# EAGLE design Power_Buggy_EFI_V3.1 (EAGLE 9.2.2)
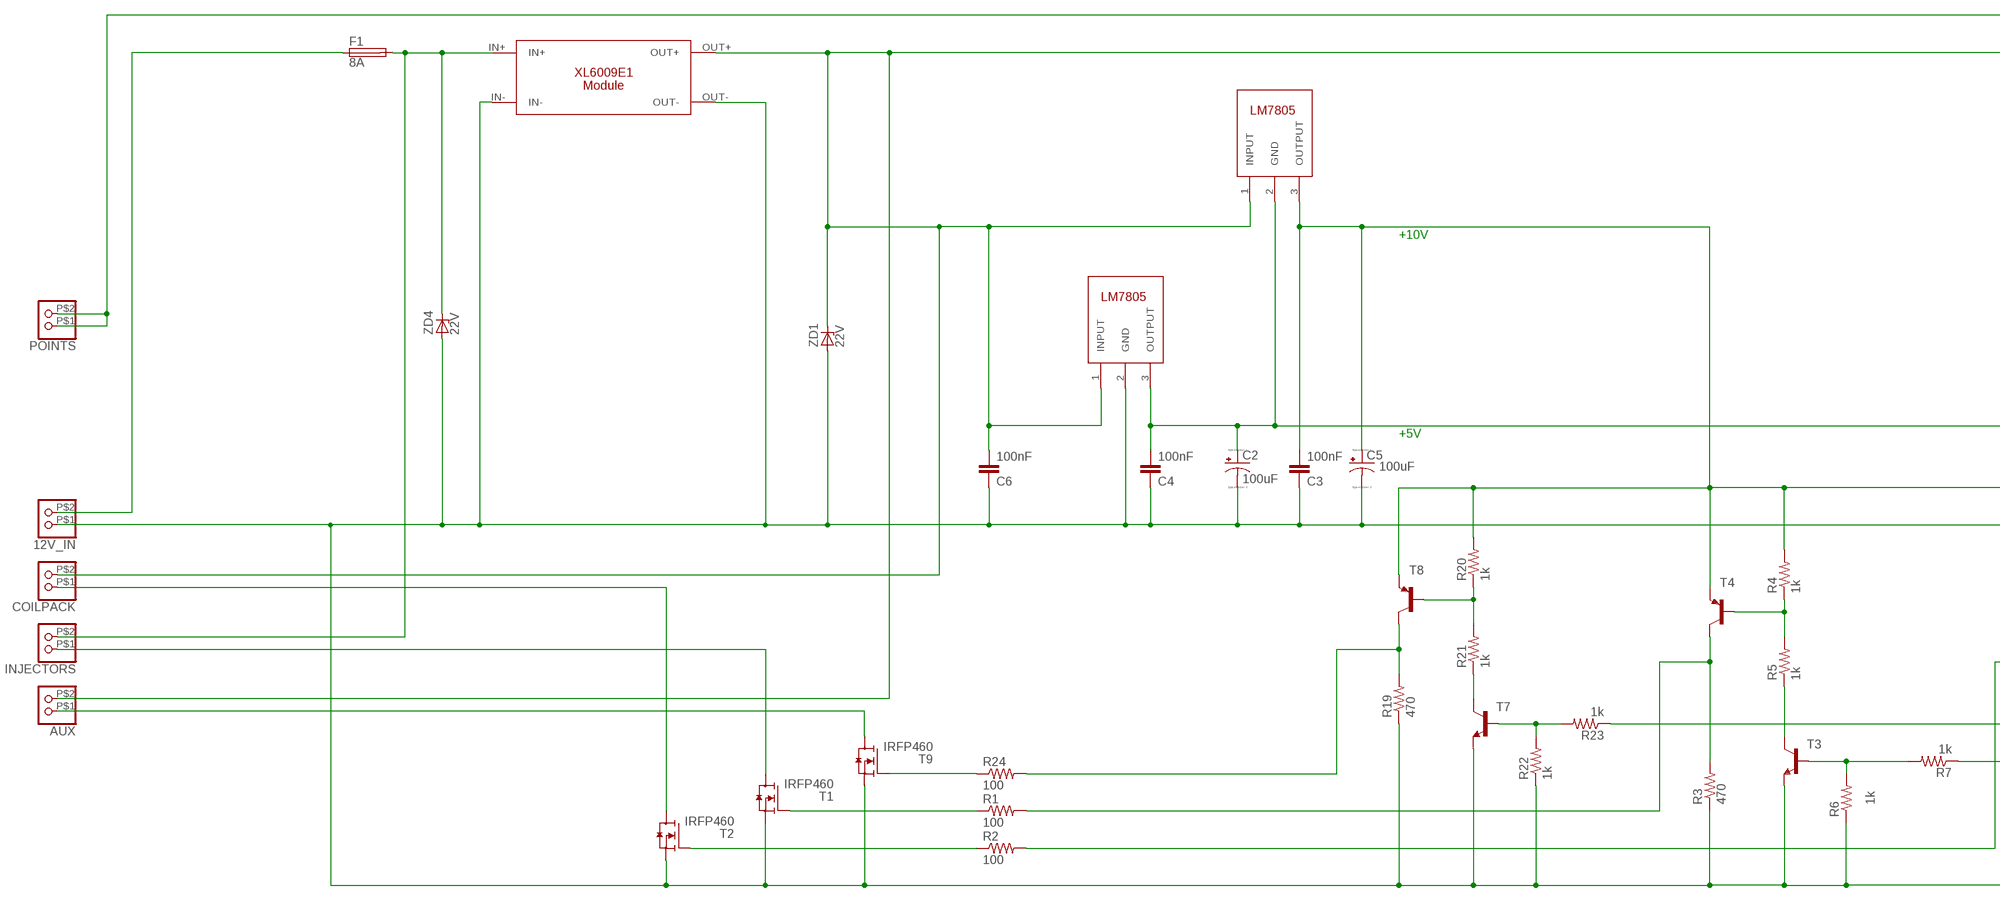
[diagram p0: schematic, sheet 1, part 1 of 2]
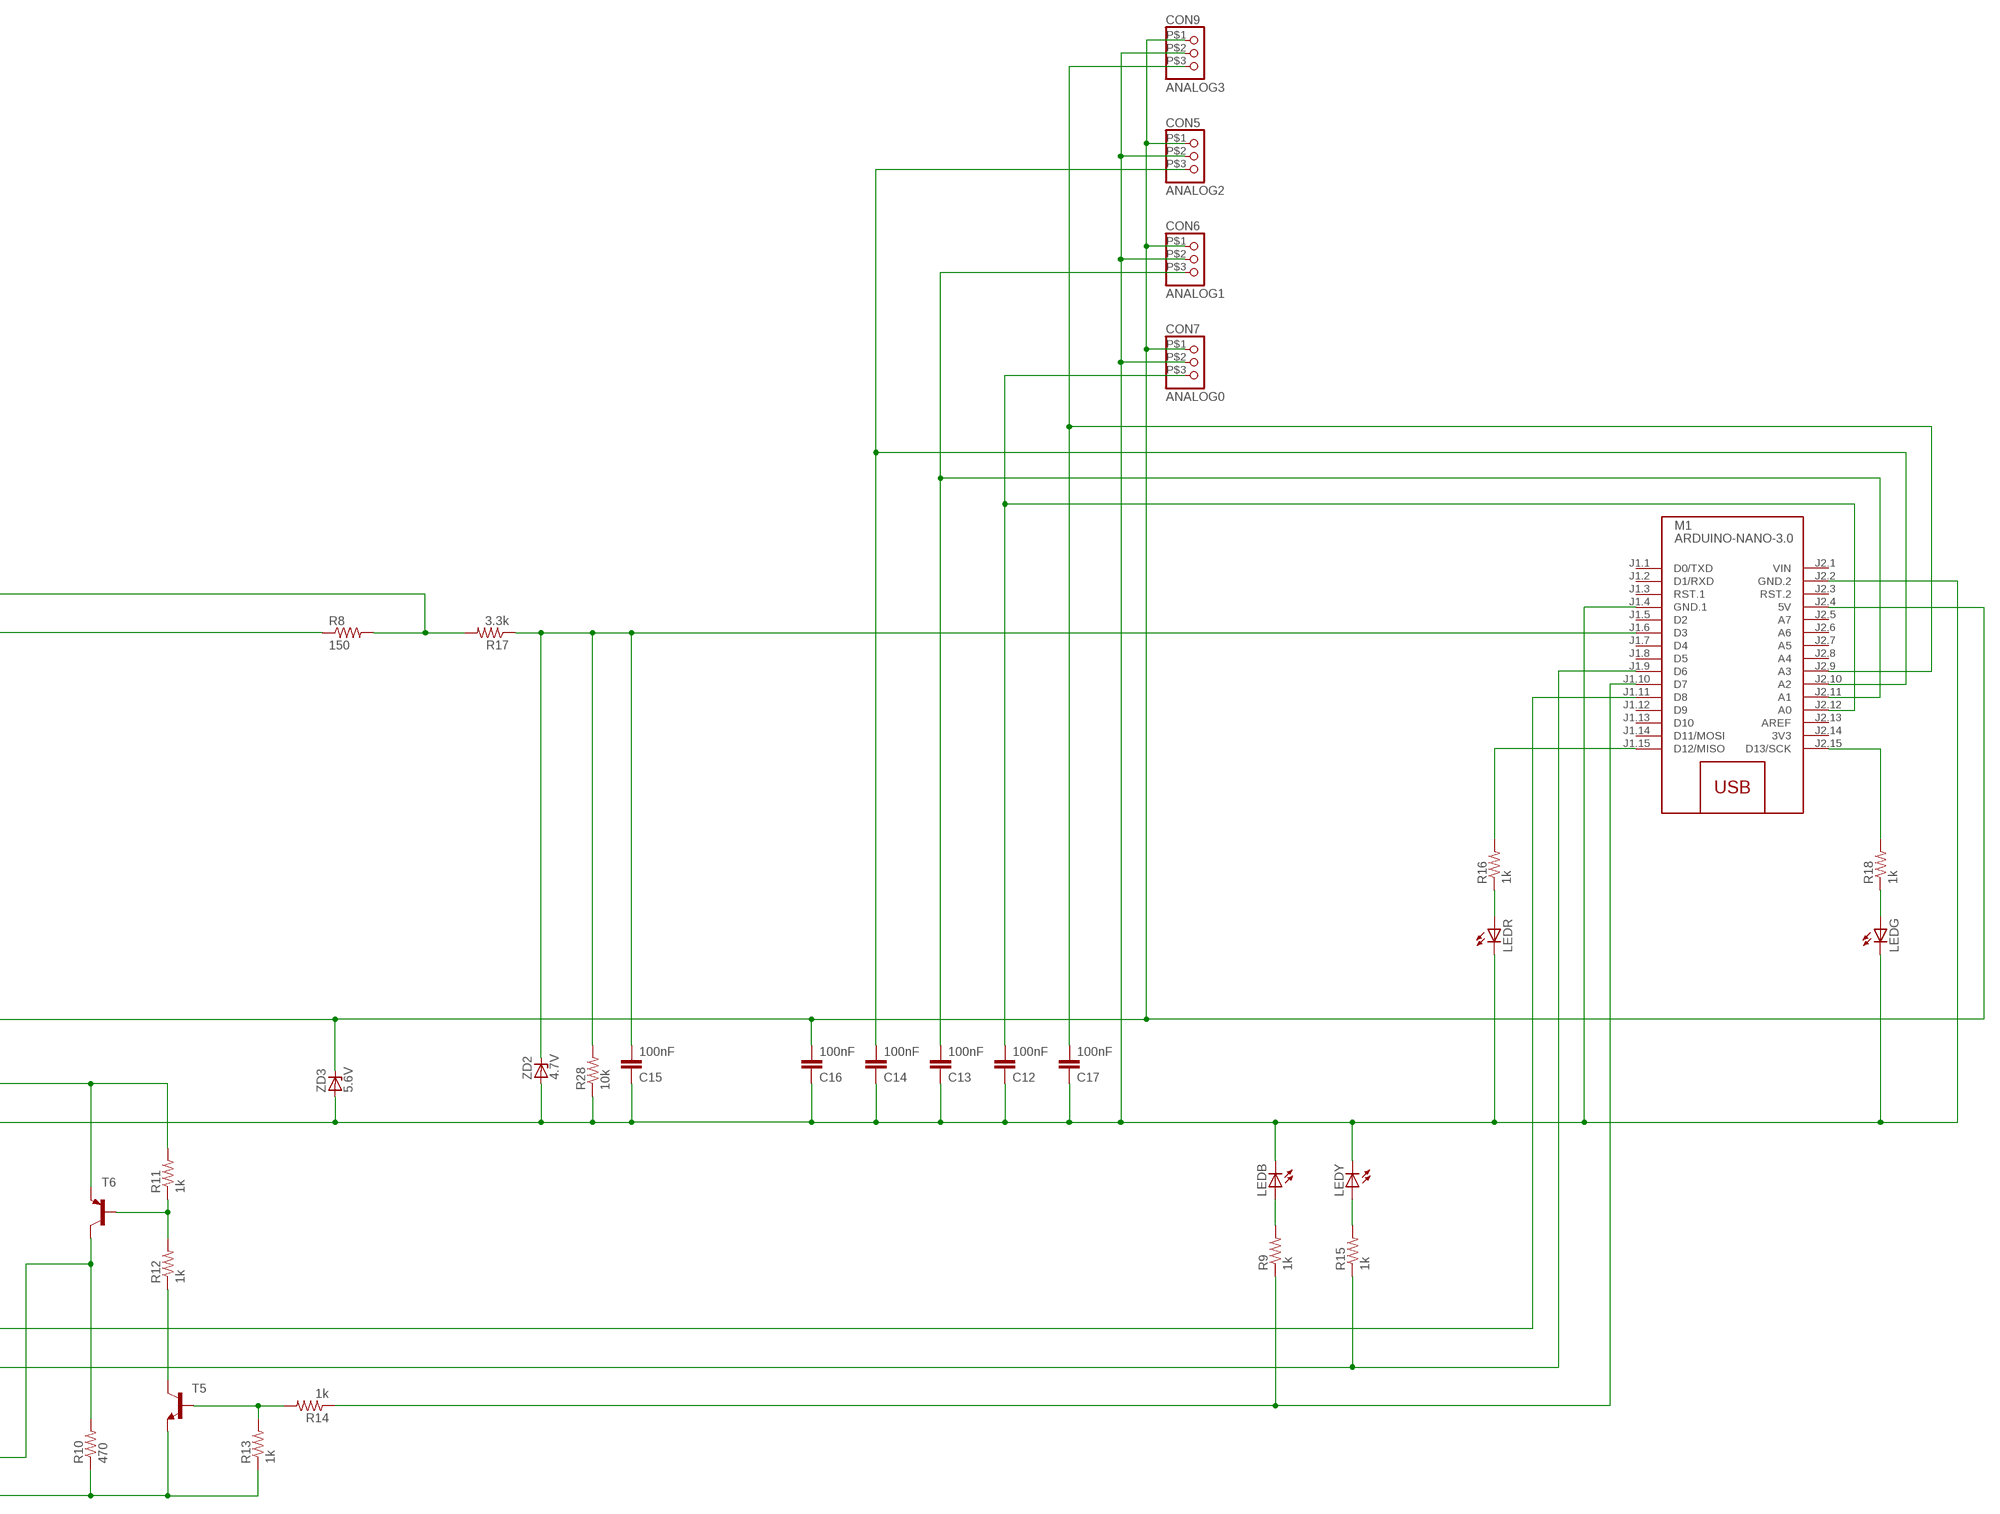
[diagram p1: schematic, sheet 1, part 2 of 2]

## Parts
12V_IN  EBBA-02-C-SS-BU  [EBBA-02-C-SS-BU]
AUX  EBBA-02-C-SS-BU  [EBBA-02-C-SS-BU]
C2  100uF  CPOL-USE2-5  [E2-5]
C3  100nF  C-EU050-025X075  [C050-025X075]
C4  100nF  C-EU050-025X075  [C050-025X075]
C5  100uF  CPOL-USE2-5  [E2-5]
C6  100nF  C-EU050-025X075  [C050-025X075]
C12  100nF  C-EU050-025X075  [C050-025X075]
C13  100nF  C-EU050-025X075  [C050-025X075]
C14  100nF  C-EU050-025X075  [C050-025X075]
C15  100nF  C-EU050-025X075  [C050-025X075]
C16  100nF  C-EU050-025X075  [C050-025X075]
C17  100nF  C-EU050-025X075  [C050-025X075]
COILPACK  EBBA-02-C-SS-BU  [EBBA-02-C-SS-BU]
CON5  ANALOG2  2.0MM_X3  [2.0MM_X3]
CON6  ANALOG1  2.0MM_X3  [2.0MM_X3]
CON7  ANALOG0  2.0MM_X3  [2.0MM_X3]
CON9  ANALOG3  2.0MM_X3  [2.0MM_X3]
F1  8A  GSH15  [GSH15]
INJECTORS  EBBA-02-C-SS-BU  [EBBA-02-C-SS-BU]
LEDB  LED3MM  [LED3MM]
LEDG  LED3MM  [LED3MM]
LEDR  LED3MM  [LED3MM]
LEDY  LED3MM  [LED3MM]
M1  ARDUINO-NANO-3.0  [ARDUINO-NANO-3.0]
POINTS  EBBA-02-C-SS-BU  [EBBA-02-C-SS-BU]
R1  100  R-US_0207/10  [0207/10]
R2  100  R-US_0207/10  [0207/10]
R3  470  R-US_0207/10  [0207/10]
R4  1k  R-US_0207/10  [0207/10]
R5  1k  R-US_0207/10  [0207/10]
R6  1k  R-US_0207/10  [0207/10]
R7  1k  R-US_0207/10  [0207/10]
R8  150  R-US_0617/22  [0617/22]
R9  1k  R-US_0207/10  [0207/10]
R10  470  R-US_0207/10  [0207/10]
R11  1k  R-US_0207/10  [0207/10]
R12  1k  R-US_0207/10  [0207/10]
R13  1k  R-US_0207/10  [0207/10]
R14  1k  R-US_0207/10  [0207/10]
R15  1k  R-US_0207/10  [0207/10]
R16  1k  R-US_0207/10  [0207/10]
R17  3.3k  R-US_0207/10  [0207/10]
R18  1k  R-US_0207/10  [0207/10]
R19  470  R-US_0207/10  [0207/10]
R20  1k  R-US_0207/10  [0207/10]
R21  1k  R-US_0207/10  [0207/10]
R22  1k  R-US_0207/10  [0207/10]
R23  1k  R-US_0207/10  [0207/10]
R24  100  R-US_0207/10  [0207/10]
R28  10k  R-US_0207/10  [0207/10]
REG1  LM7805_VERT  [TO220_VERT]
REG2  LM7805_VERT  [TO220_VERT]
T1  IRFP460  MOSFET_VERT  [TO-247_HORIZONTAL]
T2  IRFP460  MOSFET_VERT  [TO-247_HORIZONTAL]
T3  -NPN-TO92-EBC  [TO92-EBC]
T4  BCX58-PNP-TO92-EBC  [TO92-EBC]
T5  -NPN-TO92-EBC  [TO92-EBC]
T6  BCX58-PNP-TO92-EBC  [TO92-EBC]
T7  -NPN-TO92-EBC  [TO92-EBC]
T8  BCX58-PNP-TO92-EBC  [TO92-EBC]
T9  IRFP460  MOSFET_VERT  [TO-247_HORIZONTAL]
U$2  XL6009E1_MOD  [XL6009E1_MOD]
ZD1  22V  1N5333  [C1702-15]
ZD2  4.7V  1N4728  [DO41Z10]
ZD3  5.6V  1N5333  [C1702-15]
ZD4  22V  1N5333  [C1702-15]

## Nets
N$1: R19.2 R24.2 T8.C
N$2: AUX.P$2 C6.2 COILPACK.P$2 R8.1 REG1.1(INPUT) REG2.1(INPUT) U$2.OUT+ ZD1.C
N$3: 12V_IN.P$1 C2.- C3.1 C4.1 C5.- C6.1 C12.1 C13.1 C14.1 C15.1 C16.1 C17.1 CON5.P$2 CON6.P$2 CON7.P$2 CON9.P$2 LEDB.K(C) LEDG.K(C) LEDR.K(C) LEDY.K(C) M1.J1.4(GND.1) M1.J2.2(GND.2) R3.1 R6.1 R10.1 R13.1 R19.1 R22.1 R28.1 REG1.2(GND) T1.S T2.S T3.E T5.E T7.E T9.S U$2.IN- U$2.OUT- ZD1.A ZD2.A ZD3.A ZD4.A
N$4: C17.2 CON9.P$3 M1.J2.9(A3)
N$5: INJECTORS.P$1 T1.D
N$6: C3.2 C5.+ R4.2 R11.2 R20.2 REG2.3(OUTPUT) T4.E T6.E T8.E
N$7: COILPACK.P$1 T2.D
N$8: R2.1 T2.G
N$9: R1.1 T1.G
N$10: R1.2 R3.2 T4.C
N$11: R5.1 T3.C
N$12: R6.2 R7.2 T3.B
N$13: R4.1 R5.2 T4.B
N$14: M1.J1.9(D6) R7.1 R15.1
N$15: R20.1 R21.2 T8.B
N$16: M1.J1.10(D7) R9.1 R14.1
N$17: C2.+ C4.2 C16.2 CON5.P$1 CON6.P$1 CON7.P$1 CON9.P$1 M1.J2.4(5V) REG1.3(OUTPUT) REG2.2(GND) ZD3.C
N$18: F1.2 INJECTORS.P$2 U$2.IN+ ZD4.C
N$19: R2.2 R10.2 T6.C
N$20: M1.J1.15(D12/MISO) R16.2
N$21: R11.1 R12.2 T6.B
N$22: 12V_IN.P$2 F1.1
N$23: R12.1 T5.C
N$24: LEDR.A R16.1
N$25: M1.J2.15(D13/SCK) R18.2
N$26: LEDG.A R18.1
N$27: C15.2 M1.J1.6(D3) R17.1 R28.2 ZD2.C
N$28: POINTS.P$1 POINTS.P$2 R8.2 R17.2
N$29: LEDY.A R15.2
N$30: LEDB.A R9.2
N$31: R21.1 T7.C
N$33: R22.2 R23.2 T7.B
N$34: C12.2 CON7.P$3 M1.J2.12(A0)
N$35: R13.2 R14.2 T5.B
N$36: M1.J1.11(D8) R23.1
N$37: C13.2 CON6.P$3 M1.J2.11(A1)
N$38: R24.1 T9.G
N$39: AUX.P$1 T9.D
N$50: C14.2 CON5.P$3 M1.J2.10(A2)
Unconnected: M1.J1.1(D0/TXD) M1.J1.2(D1/RXD) M1.J1.3(RST.1) M1.J1.5(D2) M1.J1.7(D4) M1.J1.8(D5) M1.J1.12(D9) M1.J1.13(D10) M1.J1.14(D11/MOSI) M1.J2.3(RST.2) M1.J2.5(A7) M1.J2.6(A6) M1.J2.7(A5) M1.J2.8(A4) M1.J2.13(AREF)

## Notes on the sheet
- +10V
- +5V

## Power pins joined to a net without a drawn wire
3V3: M1.J2.14(3V3)
VIN: M1.J2.1(VIN)

## Library data of the parts
12V_IN AUX COILPACK INJECTORS POINTS = Portable_Cal_Parts_SM:EBBA-02-C-SS-BU
C2 C5 = resistor:CPOL-US: POLARIZED CAPACITOR, American symbol
C3 C4 C6 C12-C17 = resistor:C-EU: CAPACITOR, European symbol
CON5-CON7 CON9 = Power_Buggy_Parts:2.0MM_X3
F1 = fuse:GSH15: FUSE HOLDER grid 15mm, 19649 Wickmann; MPN: 64900001039; OC_FARNELL: 1271673; OC_NEWARK: 02P0318
LEDB LEDG LEDR LEDY = led:LED: LED OSRAM: - CHIPLED LG R971, LG N971, LY N971, LG Q971, LY Q971, LO R971, LY R971 LH N974, LH R974 LS Q976, LO Q976, LY Q976 LO Q996 - Hyper CHIPLED LW Q18S LB Q993, LB Q99A, LB R99A - SideLED LS A670, LO A670, LY A670, LG A670, LP A670 LB A673, LV A673, LT A673, LW A673 LH A674 LY A675 LS A676, LA A676, LO A676, LY A676, LW A676 LS A679, LY A679, LG A679 - Hyper Micro SIDELED® LS Y876, LA Y876, LO Y876, LY Y876 LT Y87S - SmartLED LW L88C, LW L88S LB L89C, LB L89S, LG L890 LS L89K, LO L89K, LY L89K LS L896, LA L896, LO L896, LY L896 - TOPLED LS T670, LO T670, LY T670, LG T670, LP T670 LSG T670, LSP T670, LSY T670, LOP T670, LYG T670 LG T671, LOG T671, LSG T671 LB T673, LV T673, LT T673, LW T673 LH T674 LS T676, LA T676, LO T676, LY T676, LB T676, LH T676, LSB T676, LW T676 LB T67C, LV T67C, LT T67C, LS T67K, LO T67K, LY T67K, LW E67C LS E67B, LA E67B, LO E67B, LY E67B, LB E67C, LV E67C, LT E67C LW T67C LS T679, LY T679, LG T679 LS T770, LO T770, LY T770, LG T770, LP T770 LB T773, LV T773, LT T773, LW T773 LH T774 LS E675, LA E675, LY E675, LS T675 LS T776, LA T776, LO T776, LY T776, LB T776 LHGB T686 LT T68C, LB T68C - Hyper Mini TOPLED® LB M676 - Mini TOPLED Santana® LG M470 LS M47K, LO M47K, LY M47K Source: http://www.osram.convergy.de LUXEON: - LUMILED® LXK2-PW12-R00, LXK2-PW12-S00, LXK2-PW14-U00, LXK2-PW14-V00 LXK2-PM12-R00, LXK2-PM12-S00, LXK2-PM14-U00 LXK2-PE12-Q00, LXK2-PE12-R00, LXK2-PE12-S00, LXK2-PE14-T00, LXK2-PE14-U00 LXK2-PB12-K00, LXK2-PB12-L00, LXK2-PB12-M00, LXK2-PB14-N00, LXK2-PB14-P00, LXK2-PB14-Q00 LXK2-PR12-L00, LXK2-PR12-M00, LXK2-PR14-Q00, LXK2-PR14-R00 LXK2-PD12-Q00, LXK2-PD12-R00, LXK2-PD12-S00 LXK2-PH12-R00, LXK2-PH12-S00 LXK2-PL12-P00, LXK2-PL12-Q00, LXK2-PL12-R00 Source: www.luxeon.com KINGBRIGHT: KA-3528ASYC Source: www.kingbright.com
M1 = diy-modules:ARDUINO-NANO-3.0: Arduino Nano 3.0
R1-R24 R28 = resistor:R-US_: RESISTOR, American symbol
REG1 REG2 = Portable_Cal_Parts_SM:LM7805_VERT
T1 T2 T9 = Inverter_Parts:MOSFET_VERT
T3 T5 T7 = transistor-neu-to92:*-NPN-: NPN Transistror
T4 T6 T8 = transistor:*-PNP-: PNP Transistror
U$2 = Power_Buggy_Parts:XL6009E1_MOD
ZD1 ZD3 ZD4 = diode:1N5333: Z DIODE 3.3 V, 5W, 5 percent (Motorola)
ZD2 = diode:1N4728: Z DIODE 3.3 V, 1W, 5 percent

## Board
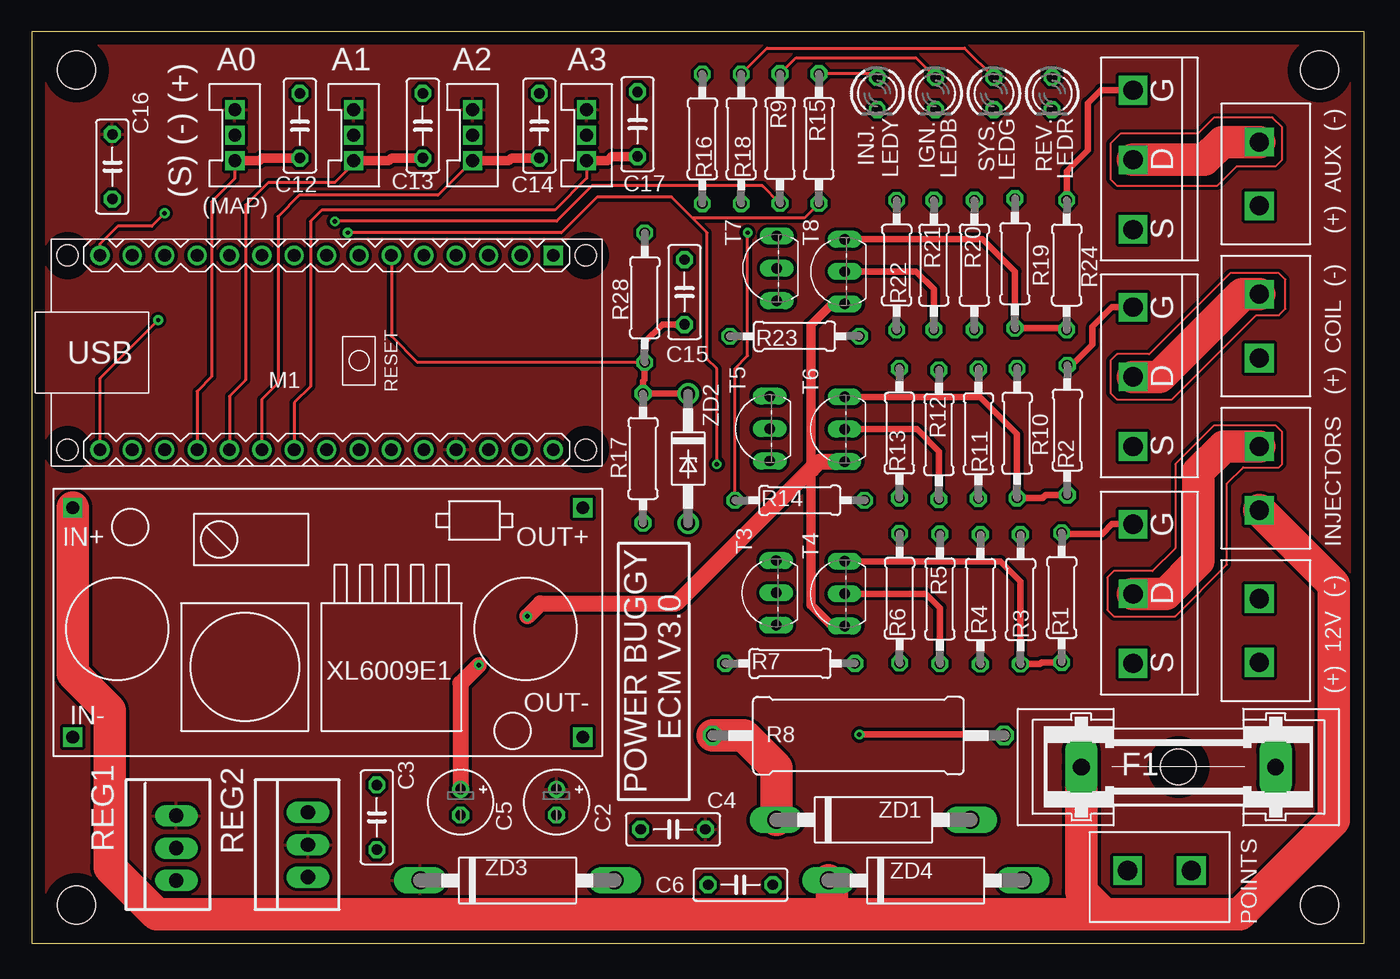
[diagram p2: board, top side]
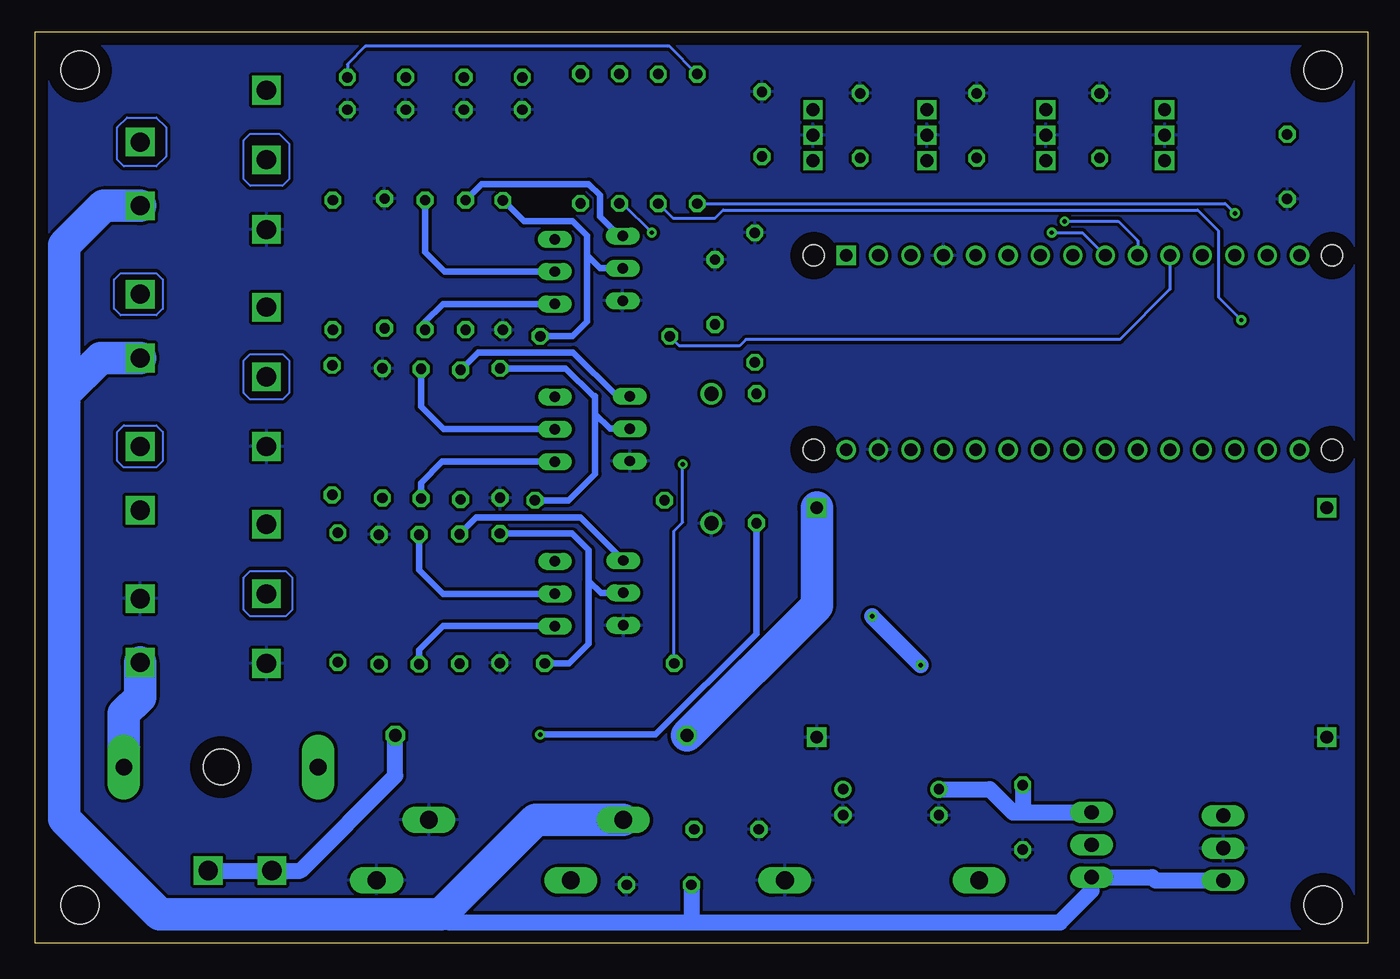
[diagram p3: board, bottom side, seen from below]

Size 104.5 x 71.5 mm. Coordinates in mm from the lower left corner, seen from the top.
Outline: 0,0 104.5,0 104.5,71.5 0,71.5 0,0
Copper layers (1*16): Top 0.035mm / dielectric 1.5mm / Bottom 0.035mm
Design rules "default *": minimum track width 6mil, minimum drill 0.35mm, track to track 10mil, track to pad 10mil, pad to pad 10mil, via to via 10mil, smd to smd 6mil, copper to edge 40mil, drill to drill 6mil, minimum pad ring 10mil, minimum via ring 8mil, stop-mask expansion 4mil, vias tented up to drill 0mil, thermal gap 10mil
Holes 3 mm at 3.5,68.5 101,68.5 3.5,3 101,3

### Footprints (pad centres in the part's own frame; a part is rotated, then mirrored left to right if it is on the bottom)
EBBA-02-C-SS-BU = drill 1.5 square: P$1 0,0; P$2 5,0
E2-5 = drill 0.813 pad 1.27: + -1.016,0 | drill 0.813 pad 1.27 octagon: - 1.016,0
C050-025X075 = drill 0.813 octagon: 1 -2.54,0; 2 2.54,0
2.0MM_X3 = drill 1 square: P$1 -2,0; P$2 0,0; P$3 2,0
GSH15 = drill 1.321 pad 2.54 long: 1 -7.62,0; 2 7.62,0 | hole 2.794: 0,0
LED3MM = drill 0.813 octagon: A -1.27,0; K 1.27,0
ARDUINO-NANO-3.0 = drill 1 square: J1.1 17.78,7.62 | drill 1: J1.2 15.24,7.62; J1.3 12.7,7.62; J1.4 10.16,7.62; J1.5 7.62,7.62; J1.6 5.08,7.62; J1.7 2.54,7.62; J1.8 0,7.62; J1.9 -2.54,7.62; J1.10 -5.08,7.62; J1.11 -7.62,7.62; J1.12 -10.16,7.62; J1.13 -12.7,7.62; J1.14 -15.24,7.62; J1.15 -17.78,7.62; J2.1 17.78,-7.62; J2.2 15.24,-7.62; J2.3 12.7,-7.62; J2.4 10.16,-7.62; J2.5 7.62,-7.62; J2.6 5.08,-7.62; J2.7 2.54,-7.62; J2.8 0,-7.62; J2.9 -2.54,-7.62; J2.10 -5.08,-7.62; J2.11 -7.62,-7.62; J2.12 -10.16,-7.62; J2.13 -12.7,-7.62; J2.14 -15.24,-7.62; J2.15 -17.78,-7.62 | hole 1.651: -20.32,7.62; -20.32,-7.62; 20.32,-7.62; 20.32,7.62
0207/10 = drill 0.813 octagon: 1 -5.08,0; 2 5.08,0
0617/22 = drill 1.016 octagon: 1 -11.43,0; 2 11.43,0
TO220_VERT = drill 1.118 long: 1 -2.51,0.28; 2 0.03,0.28; 3 2.57,0.28
TO-247_HORIZONTAL = drill 1.5 square: D 5.46,0; G 0,0; S 10.92,0
TO92-EBC = drill 0.813 long: B 0,-1.27; C 2.54,-1.27; E -2.54,-1.27
XL6009E1_MOD = drill 1 square: IN+ 41.5,1.5; IN- 41.5,19.5; OUT+ 1.5,1.5; OUT- 1.5,19.5
C1702-15 = drill 1.397 long: A 7.62,0; C -7.62,0
DO41Z10 = drill 1.118: A 5.08,0; C -5.08,0

### Placement (x,y rotation side)
12V_IN  96.27,27.04 270 top
AUX  96.27,62.86 270 top
C2  41.14,11.08 270 top
C3  27.05,9.89 90 top
C4  50.28,8.95 0 top
C5  33.62,11.08 270 top
C6  55.57,4.6 180 top
C12  21.01,64.14 270 top
C13  30.66,64.14 270 top
C14  39.8,64.14 270 top
C15  51.18,51.09 270 top
C16  6.31,60.93 90 top
C17  47.5,64.26 270 top
COILPACK  96.27,50.92 270 top
CON5  34.56,63.39 270 top
CON6  25.24,63.39 270 top
CON7  15.92,63.39 270 top
CON9  43.5,63.39 270 top
F1  89.92,13.84 180 top
INJECTORS  96.27,38.98 270 top
LEDB  70.87,66.67 270 top
LEDG  75.44,66.67 270 top
LEDR  80.01,66.67 270 top
LEDY  66.29,66.67 270 top
M1  23.11,46.35 0 top
POINTS  90.93,5.72 180 top
R1  80.76,27.13 270 top
R2  81.19,40.26 270 top
R3  77.54,26.99 270 top
R4  74.39,26.98 270 top
R5  71.21,27.03 270 top
R6  68.05,27.08 90 top
R7  59.46,21.97 0 top
R8  64.82,16.31 0 top
R9  58.67,63.13 90 top
R10  77.27,40.02 270 top
R11  74.23,39.98 270 top
R12  71.14,39.91 270 top
R13  68.03,40.03 90 top
R14  60.22,34.76 0 top
R15  61.72,63.13 90 top
R16  52.58,63.11 270 top
R17  47.93,38.05 270 top
R18  55.63,63.11 270 top
R19  77.1,53.34 270 top
R20  73.91,53.22 270 top
R21  70.74,53.22 270 top
R22  67.82,53.21 90 top
R23  59.81,47.62 0 top
R24  81.15,53.22 270 top
R28  48.06,50.66 270 top
REG1  11.6,7.45 90 top
REG2  21.93,7.71 90 top
T1  86.36,32.89 270 top
T2  86.36,49.9 270 top
T3  57.1,27.5 90 top
T4  62.46,27.43 90 top
T5  56.59,40.38 90 top
T6  62.46,40.33 90 top
T7  57.15,52.95 90 top
T8  62.48,52.7 90 top
T9  86.36,66.92 270 top
U$2  44.7,35.68 180 top
ZD1  66,9.69 0 top
ZD2  51.46,38.04 270 top
ZD3  38.08,4.95 0 top
ZD4  70.1,4.95 0 top

### Tracks (layer width: path | path; a pad name or v marks a point on that pad's centre or on a via)
N$1
  Top 0.508: R24.2 81.03,48.26 R19.2 77.1,52.7 74.56,55.24 T8.C
N$2
  Top 2.54: R8.1 55.83,16.31 58.38,13.76 ZD1.C
  Bottom 1.27: REG1.1 16.62,4.94 16.89,5.2 REG2.1 21.65,4.13 24.13,1.65 53.34,1.65 | 72.64,2.29 72.01,1.65 53.34,1.65 | C6.2 53.03,1.96 53.34,1.65
  Bottom 2.54: AUX.P$2 99.11,57.86 102.21,54.76 102.21,43.07 | 102.21,43.07 102.21,9.76 94.74,2.29 72.64,2.29 65.24,9.69 ZD1.C | COILPACK.P$2 99.37,45.92 102.21,43.07 | U$2.OUT+ 43.2,26.49 R8.1
N$3
  pour Bottom: 0,71.63 104.65,71.63 104.65,0.25 0,0.25
N$4
  Top 0.254: CON9.P$3 43.5,60.01 41.02,57.53 22.73,57.53 21.84,56.64 21.84,43.69 20.57,42.42 M1.J2.9
  Top 0.762: CON9.P$3 45.13,61.39 45.47,61.72 C17.2
N$5
  Top 2.54: INJECTORS.P$1 93.47,38.98 91.49,37 91.49,30 88.92,27.43 T1.D
N$6  (via drill 0.35)
  Top 0.762: T8.E 62.73,50.16 61.09,48.51 61.09,37.21 61.09,26.54 62.74,24.89 T4.E
  Top 1.27: C5.+ 33.62,20.41 v35.05,21.84 | v38.86,25.65 39.88,26.67 50.55,26.67 61.09,37.21 61.19,37.21 61.77,37.79 T6.E
  Bottom 0.508: T4.E 72.52,24.89 74.39,23.02 R4.2 | R11.2 74.23,36.13 72.57,37.79 T6.E | T8.E 72.52,50.16 73.91,48.77 R20.2
  Bottom 1.27: C5.+ 29.62,12.1 27.81,10.28 26.92,10.28 | 26.92,10.28 REG2.3 | C3.2 27.05,10.41 26.92,10.28 | v38.86,25.65 v35.05,21.84
N$7
  Top 2.54: COILPACK.P$1 94.91,50.92 88.44,44.44 T2.D
N$8
  Top 0.508: R2.1 81.54,45.34 83.19,46.99 83.19,48.39 84.7,49.9 T2.G
N$9
  Top 0.508: T1.G 84.7,32.89 83.95,32.13 80.84,32.13 R1.1
N$10
  Top 0.508: R1.2 79.2,22.05 79.06,21.91 R3.2 77.54,28.38 75.95,29.97 T4.C
N$11
  Bottom 0.508: T3.C 61.73,33.4 69.92,33.4 R5.1
N$12
  Bottom 0.508: R6.2 62.38,32.16 61.09,30.86 61.09,28.45 | T3.B 60.14,27.5 61.09,28.45 | R7.2 62.61,21.97 61.09,23.5 61.09,28.45
N$13
  Top 0.508: R5.2 71.21,26.32 70.11,27.43 T4.B
  Bottom 0.508: T4.B 72.52,27.43 74.39,29.3 R4.1
N$14  (via drill 0.35)
  Top 0.254: R15.1 60.57,56.9 51.82,56.9 | 51.82,56.9 50.16,58.55 44.32,58.55 41.53,55.75 v24.77,55.75 | v53.72,37.59 53.72,45.09 52.96,45.85 52.96,55.75 51.82,56.9
  Bottom 0.254: v24.77,55.75 22.36,55.75 M1.J1.9 | R7.1 54.38,32.36 53.72,33.02 v53.72,37.59
N$15
  Top 0.508: R21.2 70.74,51.31 69.34,52.7 63.76,52.7 T8.B
  Bottom 0.508: R20.1 73.91,54.23 72.38,52.7 T8.B
N$16  (via drill 0.35)
  Top 0.254: R9.1 57.28,59.44 43.94,59.44 41.15,56.64 v23.75,56.64 | R14.1 55.14,45.11 56.13,46.1 v56.13,55.75
  Bottom 0.254: v23.75,56.64 19.56,56.64 18.03,55.12 M1.J1.10 | R9.1 58.43,58.05 v56.13,55.75
N$17
  pour Top: 0,71.63 104.65,71.63 104.65,0.25 0,0.25
N$18
  Top 2.54: INJECTORS.P$2 102.11,28.14 102.11,9.65 94.74,2.29 84.07,2.29 | 84.07,2.29 82.3,4.06 F1.2 | U$2.IN+ 3.2,21.18 6.1,18.29 6.1,5.99 9.8,2.29 62.74,2.29 | 62.74,2.29 84.07,2.29 | ZD4.C 62.74,4.69 62.74,2.29
N$19
  Top 0.508: T6.C 74.35,42.87 77.27,39.95 R10.2 77.28,34.92 79.25,34.92 79.51,35.18 R2.2
N$20  (via drill 0.35)
  Top 0.254: v10.41,57.28 9.4,56.26 6.73,56.26 5.33,54.86 M1.J1.15
  Bottom 0.254: R16.2 11.17,58.03 v10.41,57.28
N$21
  Top 0.508: R12.2 71.14,38.59 69.39,40.33 T6.B
  Bottom 0.508: R11.1 74.23,42.1 72.47,40.33 T6.B
N$22
  Bottom 2.54: 12V_IN.P$2 96.27,19.3 97.54,18.03 F1.1
N$23
  Bottom 0.508: R12.1 69.77,46.35 62.31,46.35 58.87,42.92 T5.C
N$24
  Bottom 0.254: R16.1 54.74,70.36 78.61,70.36 80.01,68.96 LEDR.A
N$25  (via drill 0.35)
  Top 0.254: v9.91,48.9 5.33,44.32 M1.J2.15
  Bottom 0.254: R18.2 54.49,56.9 51.18,56.9 50.55,57.52 13.33,57.52 11.68,55.88 11.68,50.67 v9.91,48.9
N$26
  Top 0.254: R18.1 57.66,70.23 73.15,70.23 LEDG.A
N$27
  Top 0.254: M1.J1.6 28.19,47.62 30.23,45.59 48.05,45.59 R28.2
  Top 0.508: C15.2 49.44,48.55 48.05,47.16 48.05,45.59 48.05,44.23 47.93,44.12 R17.1 47.93,43.12 ZD2.C
N$28  (via drill 0.35)
  Top 0.508: R8.2 76.17,16.38 v64.9,16.38
  Bottom 0.508: R17.2 47.93,24.28 55.83,16.38 v64.9,16.38
  Bottom 1.27: POINTS.P$1 POINTS.P$2 83.69,5.72 76.25,13.16 R8.2
N$29
  Top 0.254: LEDY.A 66.03,68.21 R15.2
N$30
  Top 0.254: R9.2 59.94,69.47 69.33,69.47 LEDB.A
N$31
  Bottom 0.508: R21.1 69.48,59.56 61.09,59.56 60.2,58.67 60.2,57.02 58.67,55.49 T7.C
N$32
  Top 0.152: 85.34,63.5 84.58,62.74 84.58,59.94 85.09,59.44 92.96,59.44 94.49,60.96 97.54,60.96 98.04,61.47 98.04,64.01 97.28,64.77 92.71,64.77 91.44,63.5 85.34,63.5
N$33
  Bottom 0.508: 61.21,53.98 61.21,55.5 62.36,56.64 66.17,56.64 R22.2 | 61.21,53.98 60.19,52.95 T7.B | R23.2 62.36,47.62 61.21,48.77 61.21,53.98
N$34
  Top 0.254: CON7.P$3 15.92,59.99 14.1,58.17 14.1,44.45 12.95,43.31 M1.J2.12
  Top 0.762: CON7.P$3 17.83,61.39 18.04,61.6 C12.2
N$35
  Bottom 0.508: R14.2 62.65,34.76 60.58,36.83 60.58,41.53 | 60.58,41.53 60.58,42.93 60.71,42.93 62.89,45.11 R13.2 | T5.B 59.43,40.38 60.58,41.53
N$36
  Bottom 0.254: M1.J1.11 15.49,51.31 19.43,47.37 48.77,47.37 49.28,46.86 53.97,46.86 R23.1
N$37
  Top 0.254: CON6.P$3 25.24,61.18 23.75,59.69 18.54,59.69 16.76,57.91 16.76,44.2 15.49,42.93 M1.J2.11
  Top 0.762: CON6.P$3 27.99,61.39 28.2,61.6 C13.2
N$38
  Top 0.508: R24.1 81.15,60.58 82.8,62.23 82.8,65.91 83.82,66.93 T9.G
N$39
  Top 2.54: AUX.P$1 93.35,62.86 91.95,61.46 T9.D
N$40
  Top 0.152: 93.98,52.58 87.63,46.23 85.09,46.23 84.58,45.72 84.58,43.18 85.09,42.67 89.41,42.67 96.01,49.28 97.79,49.28 98.3,49.78 98.3,52.07 97.79,52.58 93.98,52.58
N$41
  Top 0.152: 87.88,29.21 84.84,29.21 84.33,28.7 84.33,26.16 84.84,25.65 89.66,25.65 93.73,29.72 93.73,36.07 95,37.34 97.79,37.34 98.04,37.59 98.04,40.13 97.54,40.64 92.71,40.64 89.66,37.59 89.66,30.99 87.88,29.21
N$42
  Bottom 0.152: 84.58,62.74 84.58,59.94 85.09,59.44 87.63,59.44 88.14,59.94 88.14,62.99 87.63,63.5 85.34,63.5 84.58,62.74
N$43
  Bottom 0.152: 97.28,64.77 95,64.77 94.23,64.01 94.23,61.72 95,60.96 97.54,60.96 98.04,61.47 98.04,64.01 97.28,64.77
N$44
  Bottom 0.152: 85.09,46.23 84.58,45.72 84.58,43.18 85.09,42.67 87.63,42.67 88.14,43.18 88.14,45.72 87.63,46.23 85.09,46.23
N$45
  Bottom 0.152: 97.79,52.58 95,52.58 94.49,52.07 94.49,49.78 95,49.28 97.79,49.28 98.3,49.78 98.3,52.07 97.79,52.58
N$46
  Bottom 0.152: 84.84,29.21 84.33,28.7 84.33,26.16 84.84,25.65 87.63,25.65 88.14,26.16 88.14,28.7 87.63,29.21 84.84,29.21
N$47
  Bottom 0.152: 97.54,40.64 95,40.64 94.49,40.13 94.49,37.85 95,37.34 97.54,37.34 98.04,37.85 98.04,40.13 97.54,40.64
N$50
  Top 0.254: CON5.P$3 31.84,58.67 20.95,58.67 19.3,57.02 19.3,43.94 18.03,42.67 M1.J2.10
  Top 0.762: CON5.P$3 37.39,61.39 37.6,61.6 C14.2

### Text on the board
tPlace: A0 | A1 | A2 | A3 | (+) AUX (-) | INJ. | IGN. | SYS. | REV. | (MAP) | (S) (-) (+) | (+) COIL (-) | INJECTORS | (+) 12V (-) | POWER BUGGY / ECM V3.0 | POINTS